# Altium project PCB_rc_receiver.PrjPcb
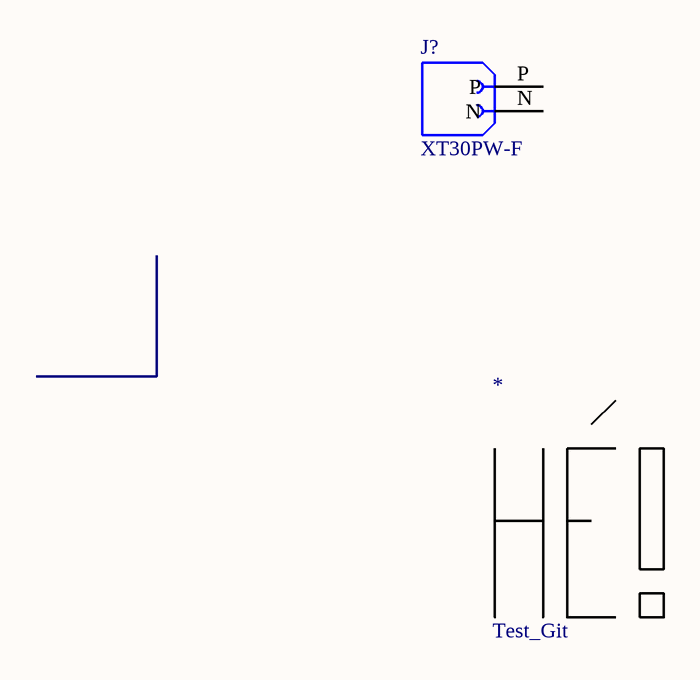
[diagram p0: Schema_rc_receiver.SchDoc]
1 sheet, 2 parts. Net scope: global (net labels, ports and power ports of the same name join across sheets).

## Sheet Schema_rc_receiver.SchDoc
size A4; SheetNumber: 1; SheetTotal: 1

### Parts
*  Test_Git
J?  XT30PW-F  [AMASS_XT30PW-F]

### Nets

Not connected (* = marked no-connect by the designer): J? N P

### Library data of the parts
J? = XT30PW-F: Socket; DC supply; XT30; female; PIN: 2; on PCBs; THT; yellow; 15A; MF: amass; SnapEDA_Link: https://www.snapeda.com/parts/XT30PW-F/AMASS/view-part/?ref=snap; Package: None; Value: *; MP: XT30PW-F; Check_prices: https://www.snapeda.com/parts/XT30PW-F/AMASS/view-part/?ref=eda